# Altium project LM2576_BOARD.PrjPCB
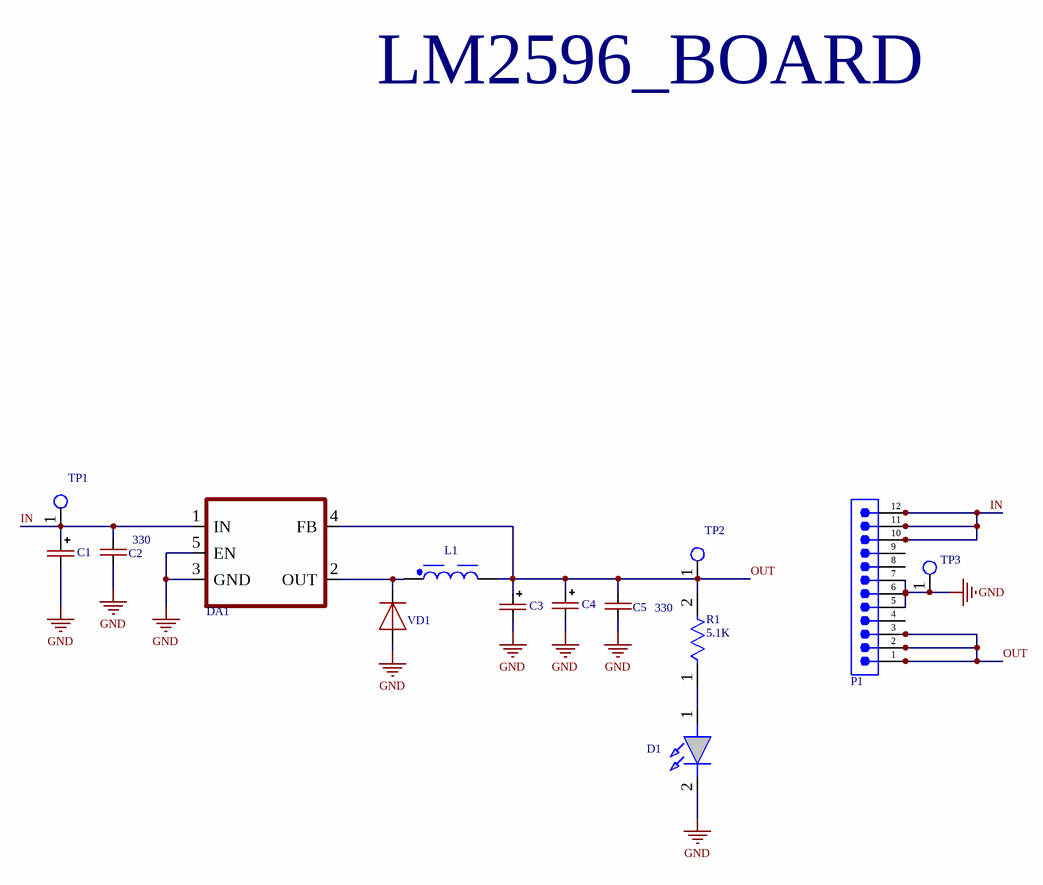
[diagram p0: LM2576_BOARD.SchDoc]
1 sheet, 14 parts. Net scope: global (net labels, ports and power ports of the same name join across sheets).
Board file: LM2576_BOARD.PcbDoc

## Sheet LM2576_BOARD.SchDoc
size A1; SPICEModelCacheYQEDCYZF: <root> / <DocumentId>YQEDCYZF</DocumentId> / <CacheFrame Number="0"> / <Model Name="7850_744775147_47u" Kind="CKT"> / <Text>******* / .subckt 7850_744775147_47u 1 2 / Rp 1 2 40000 / Cp 1 2 4p / Rs 1 N3 0.1343 / L1 N3 2 47u / .ends 7850_744775147_47u</Text> / </Model> / </CacheFrame> / </root>

### Parts
C1  CAP-POLAR  [SIZE_EEE]  (value not drawn)
C2  330  [CAP-0805]
C3  CAP-POLAR  [SIZE_EEE]  (value not drawn)
C4  CAP-POLAR  [SIZE_EEE]  (value not drawn)
C5  330  [CAP-0805]
D1  151031YS06000  [LED_RED]  (value not drawn)
DA1  LM2576  [TO-263-5]  (value not drawn)
L1  47µH, 1.17A  [WE-PD2_7850]  (value not drawn)
P1  61301211021  [61301211021]  (value not drawn)
R1  5.1K  [RES-0805]
TP1  (no value)  [Test_Point]
TP2  (no value)  [Test_Point]
TP3  (no value)  [Test_Point]
VD1  DIODE  [DO-214AB]  (value not drawn)

### Nets
GND: C1.2(-) C2.1 C3.2(-) C4.2(-) C5.1 D1.2(K) DA1.3(GND) DA1.5(EN) P1.5 P1.6 P1.7 TP3.1(G9) VD1.2(A)
IN: C1.1(+) C2.2 DA1.1(IN) P1.10 P1.11 P1.12 TP1.1(G9)
OUT: C3.1(+) C4.1(+) C5.2 DA1.4(FB) L1.2 P1.1 P1.2 P1.3 R1.2 TP2.1(G9)
NetD1_1: D1.1(A) R1.1
NetDA1_2: DA1.2(OUT) L1.1 VD1.1(C)

Not connected (* = marked no-connect by the designer): P1 4 8 9

### Notes on the sheet
- LM2596_BOARD

### Library data of the parts
C2 C5 = CAP-NON-POLAR
D1 = LED: WURTH ELEKTRONIK - 151031YS06000 - LED, Yellow, Through Hole, T-1 (3mm), 30 mA, 2 V, 590 nm; Geometry.Height: 5.5mm; Manufacturer_Name: Wurth Elektronik; Manufacturer_Part_Number: 151031YS06000; Mouser Part Number: 710-151031YS06000; Mouser Price/Stock: https://www.mouser.co.uk/ProductDetail/Wurth-Elektronik/151031YS06000?qs=LlUlMxKIyB3xSYYW%252BcuBiQ%3D%3D; Arrow Part Number: *; Arrow Price/Stock: *; Mouser Testing Part Number: *; Mouser Testing Price/Stock: *; Datasheet Link: https://katalog.we-online.de/led/datasheet/151031YS06000.pdf
L1 = 744775147: WE-PD2 SMT Power Inductor, size 7850, 47µH, 1.17A, 0.18Ω; Manufacturer: Wurth Elektronik; Case/Size Code: 7850; DC Resistance: 0.134Ω; Saturation Current: 1.24A; Self Resonant Frequency: 12MHz; Manufacturer Part Number: 744775147; Category: Unshielded Power Inductors; Match Code: WE-PD2; ComponentLink1Description: Website Link; ComponentLink1URL: https://www.we-online.com/redexpert/article/744775147?ad; ComponentLink2Description: Datasheet Link; ComponentLink2URL: https://www.we-online.com/redexpert/spec/744775147?ad; Mount: Surface Mount; Operating Temperature Max: 125°C; Operating Temperature Min: -40°C; Packaging: Tape and Reel; Length: 7.8mm; Width: 7mm; Height: 4.95mm; DC Resistance Max: 0.18Ω; Inductance: 47µH; Rated Current: 1.17A
P1 = 61301211021: WR-PHD Pin Header, THT, Angled, pitch 2.54mm, 1 Row, 12P; Manufacturer: Wurth Elektronik; Contact Resistance: 20mΩ; Rated Current: 3A; Working Voltage: 250V; Withstanding Voltage: 500V; ComponentLink1Description: Website Link; ComponentLink1URL: https://www.we-online.com/redexpert/article/61301211021?ad; ComponentLink2Description: Datasheet Link; ComponentLink2URL: https://www.we-online.com/redexpert/spec/61301211021?ad; Manufacturer Part Number: 61301211021; Category: Board-to-Board Connectors; Match Code: WR-PHD; Mount: Through Hole; Operating Temperature Max: 105°C; Operating Temperature Min: -40°C; Packaging: Bag; Gender: Pin Header; Number of Pins: 12; Number of Rows: 1; Orientation: Angled; Pitch: 2.54mm
R1 = RES-CONST
TP1-TP3 = TP_PCB?: Test_Point